# Altium project V_1.PrjPcb
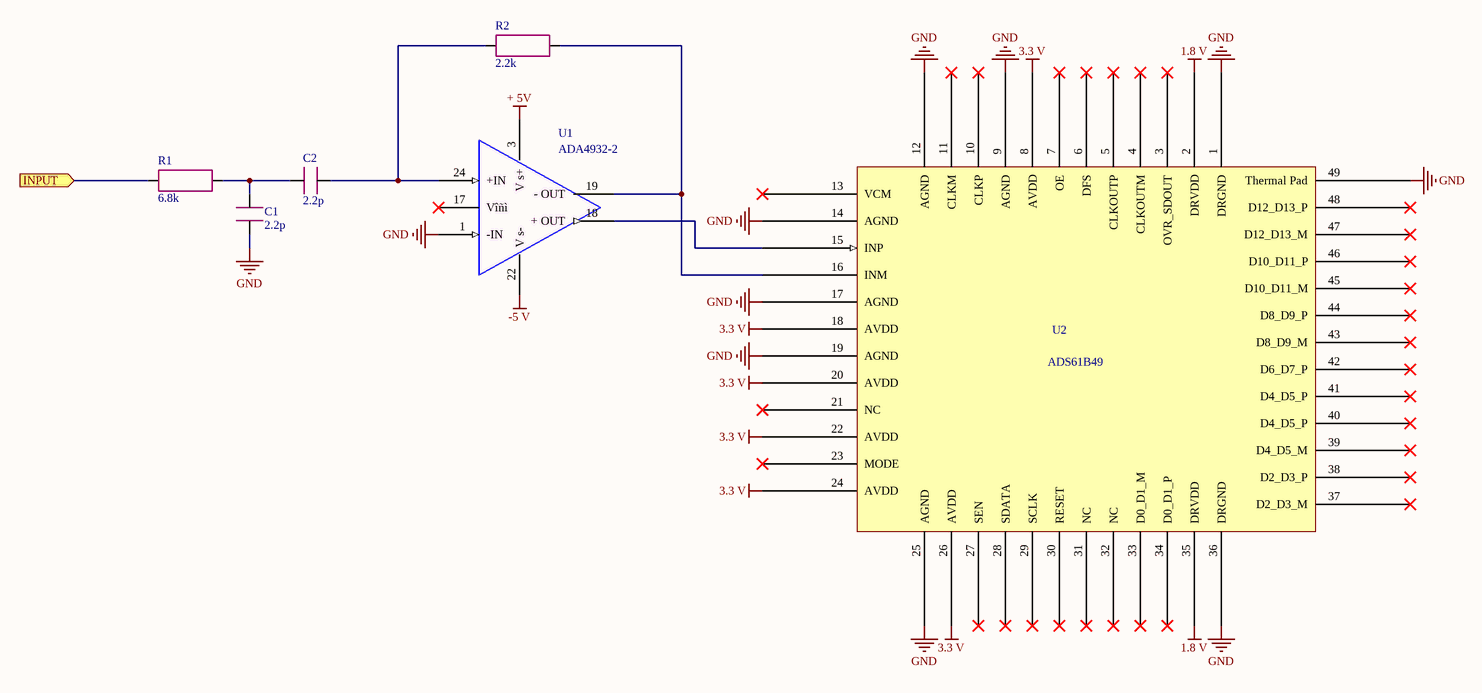
[diagram p0: V_1.SchDoc]
1 sheet, 6 parts. Net scope: flat (ports and power ports of the same name join across sheets).
Board file: V_1.PcbDoc

## Sheet V_1.SchDoc
size A3

### Parts
C1  2.2p  [C_0805]
C2  2.2p  [C_0805]
R1  6.8k  [R_0805]
R2  2.2k  [R_0805]
U1  ADA4932-2  [ADA4932-2]
U2  ADS61B49  [ADS61B49]

### Ports
INPUT (in)

### Nets
1.8 V: U2.2(DRVDD) U2.35(DRVDD)
3.3 V: U2.8(AVDD) U2.18(AVDD) U2.20(AVDD) U2.22(AVDD) U2.24(AVDD) U2.26(AVDD)
+ 5V: U1.3(V_s+)
-5 V: U1.22(V_s-)
GND: C1.1 U1.1(-IN) U2.1(DRGND) U2.9(AGND) U2.12(AGND) U2.14(AGND) U2.17(AGND) U2.19(AGND) U2.25(AGND) U2.36(DRGND) U2.49(Thermal_Pad)
NetC1_2: C1.2 C2.1 R1.2
NetC2_2: C2.2 R2.1 U1.24(+IN)
NetR1_1: R1.1 ; port INPUT
NetR2_2: R2.2 U1.19(-_OUT) U2.16(INM)
NetU1_18: U1.18(+_OUT) U2.15(INP)

Not connected (* = marked no-connect by the designer): U1 17(Vîñì)*; U2 3(OVR_SDOUT)* 4(CLKOUTM)* 5(CLKOUTP)* 6(DFS)* 7(OE)* 10(CLKP)* 11(CLKM)* 13(VCM)* 21(NC)* 23(MODE)* 27(SEN)* 28(SDATA)* 29(SCLK)* 30(RESET)* 31(NC)* 32(NC)* 33(D0_D1_M)* 34(D0_D1_P)* 37(D2_D3_M)* 38(D2_D3_P)* 39(D4_D5_M)* 40(D4_D5_P)* 41(D4_D5_P)* 42(D6_D7_P)* 43(D8_D9_M)* 44(D8_D9_P)* 45(D10_D11_M)* 46(D10_D11_P)* 47(D12_D13_M)* 48(D12_D13_P)*

### Notes on the sheet
- Title
- Size:
- Date:
- A3
- Number:
- Time:
- Revision:
- Sheet
- of
- File:

### Library data of the parts
C1 C2 = C
R1 R2 = R